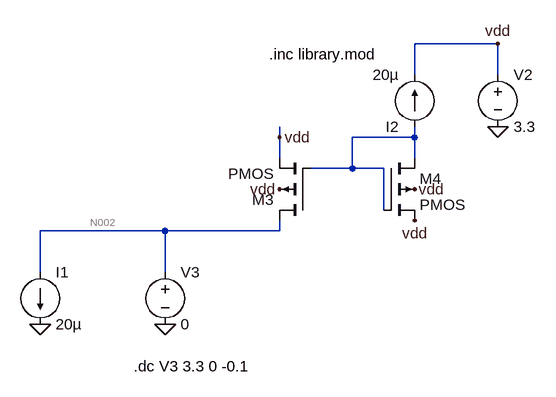
[diagram p0: schematic Draft6.asc]
Draft6.asc, the LTspice schematic file:
Version 4
SHEET 1 880 680
WIRE 368 32 240 32
WIRE 240 80 240 32
WIRE 368 80 368 32
WIRE 32 176 32 160
WIRE 240 176 240 160
WIRE 240 176 144 176
WIRE 32 208 32 176
WIRE 240 208 240 176
WIRE 144 224 144 176
WIRE 144 224 80 224
WIRE 192 224 144 224
WIRE 192 288 192 224
WIRE -144 320 -336 320
WIRE 32 320 32 304
WIRE 32 320 -144 320
WIRE -336 384 -336 320
WIRE -144 384 -144 320
FLAG -336 464 0
FLAG -144 464 0
FLAG 368 160 0
FLAG 32 176 vdd
FLAG 240 304 vdd
FLAG 368 32 vdd
FLAG 32 256 vdd
FLAG 240 256 vdd
SYMBOL current -336 384 R0
WINDOW 123 0 0 Left 0
WINDOW 39 0 0 Left 0
SYMATTR InstName I1
SYMATTR Value 20µ
SYMBOL current 240 160 R180
WINDOW 123 0 0 Left 0
WINDOW 39 0 0 Left 0
SYMATTR InstName I2
SYMATTR Value 20µ
SYMBOL pmos4 80 304 R180
SYMATTR InstName M3
SYMATTR Value2 l=1u w=1u
SYMBOL pmos4 192 208 R0
SYMATTR InstName M4
SYMATTR Value2 l=1u w=1u
SYMBOL voltage -144 368 R0
WINDOW 123 0 0 Left 0
WINDOW 39 0 0 Left 0
SYMATTR InstName V3
SYMATTR Value 0
SYMBOL voltage 368 64 R0
WINDOW 123 0 0 Left 0
WINDOW 39 0 0 Left 0
SYMATTR InstName V2
SYMATTR Value 3.3
TEXT 16 48 Left 2 !.inc library.mod
TEXT -192 528 Left 2 !.dc V3 3.3 0 -0.1

The netlist it stands for:
* Draft6.asc
I1 N002 0 20µ
I2 N001 vdd 20µ
M3 N002 N001 vdd vdd PMOS l=1u w=1u
M4 N001 N001 vdd vdd PMOS l=1u w=1u
V3 N002 0 0
V2 vdd 0 3.3
.model NMOS NMOS
.model PMOS PMOS
.lib standard.mos
.inc library.mod
.dc V3 3.3 0 -0.1
.backanno
.end

* Results of the author's LTspice run, read from the files saved beside the schematic
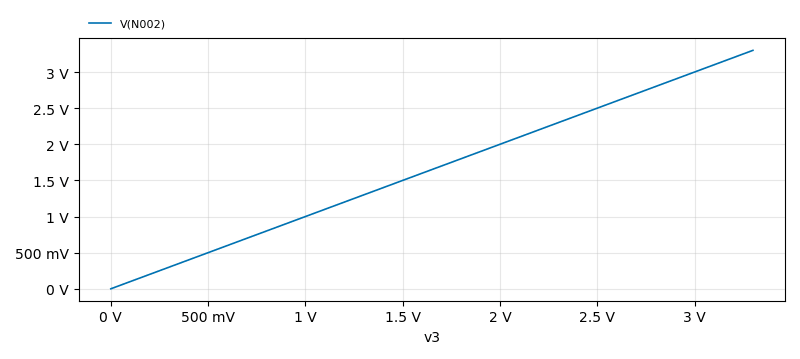
[diagram p1: DC transfer characteristic of Draft6.asc, plotted from the saved traces]
* DC transfer characteristic, 1 run:
*   V(N002): 3.3 V at v3=3.3 V, 0 V at v3=0 V, min 0 V, max 3.3 V